# Altium project num_one.PrjPCB
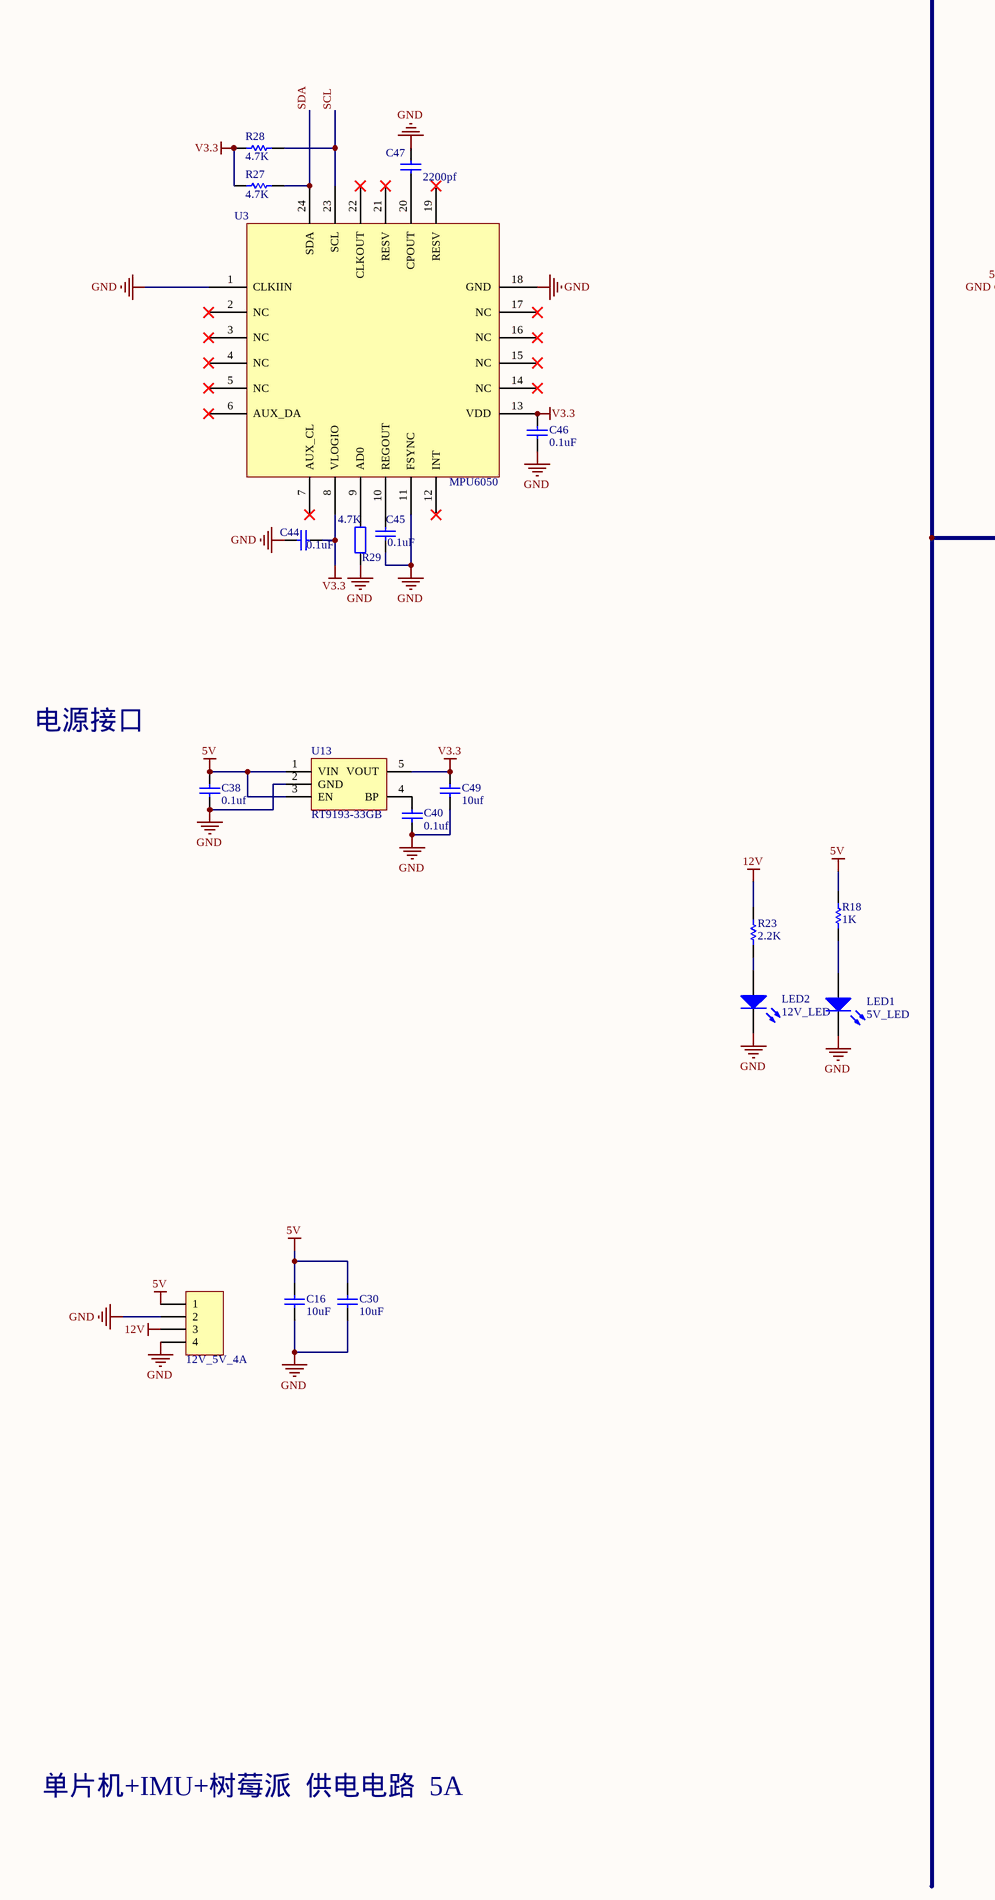
[diagram p0: num_one.SchDoc, left]
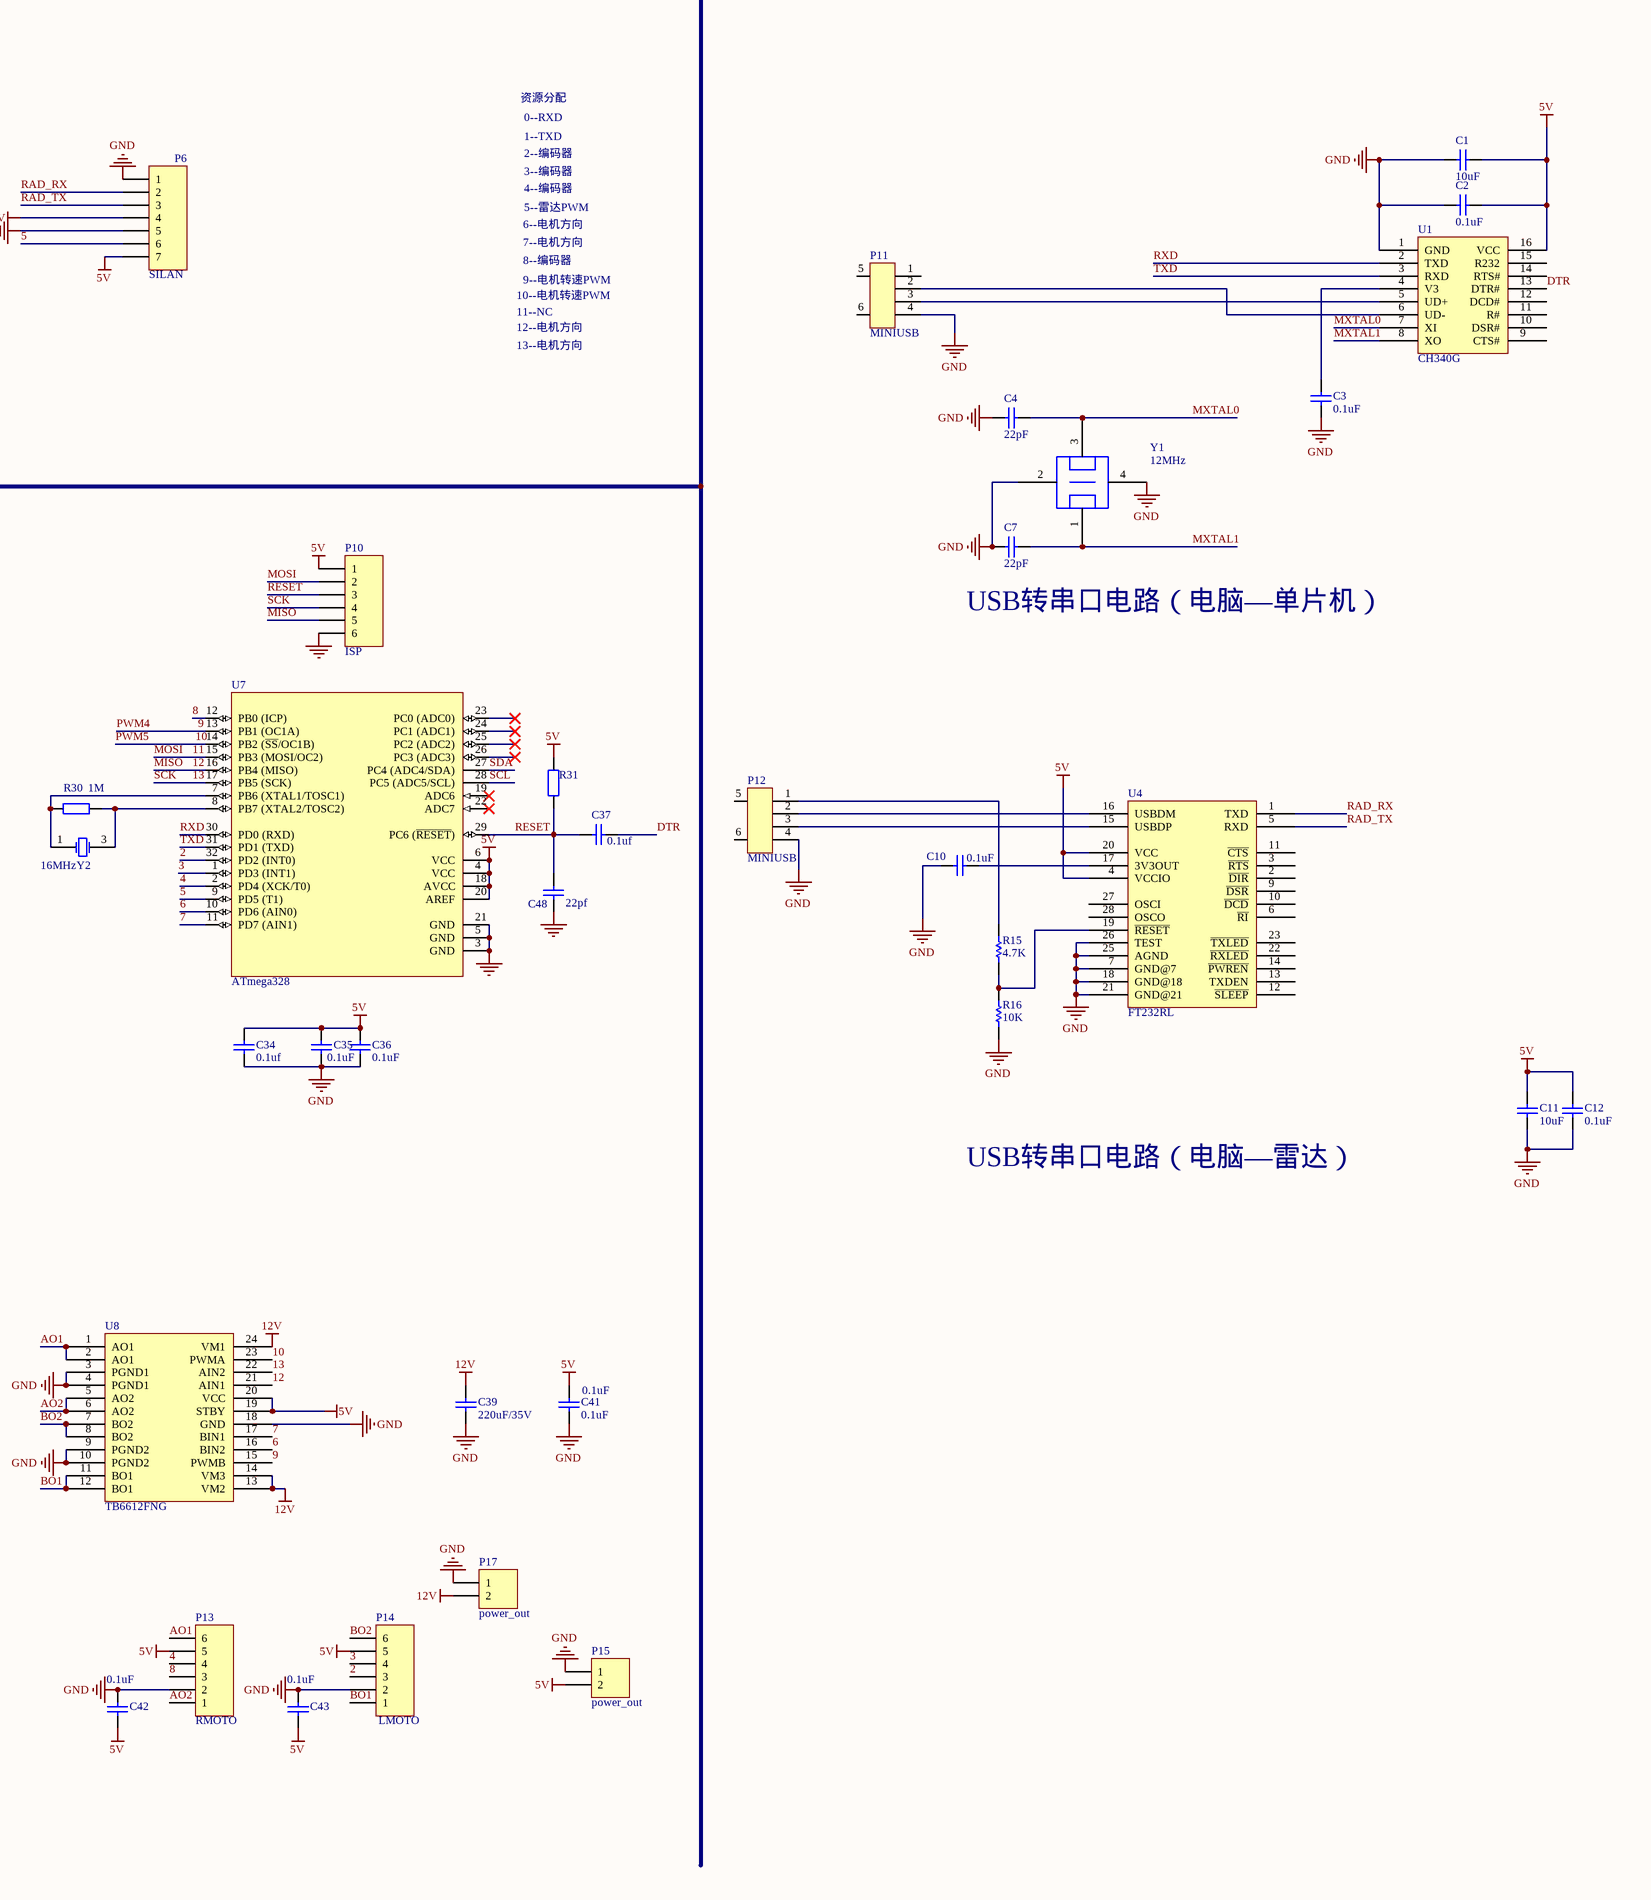
[diagram p1: num_one.SchDoc, right]
1 sheet, 54 parts. Net scope: global (net labels, ports and power ports of the same name join across sheets).
Board files: num_one.PcbDoc, ROSLOGO.PcbDoc, SLAMLOGO.PcbDoc

## Sheet num_one.SchDoc: 河南理工大学-形而上学队-原理图
size A2; Address1: 预留车灯接口; SheetNumber: 1

### Parts
C1  10uF  [0805C]
C2  0.1uF  [0805C]
C3  0.1uF  [0805C]
C4  22pF  [0805C]
C7  22pF  [0805C]
C10  0.1uF  [0805C]
C11  10uF  [0805C]
C12  0.1uF  [0805C]
C16  10uF  [0805C]
C30  10uF  [0805C]
C34  0.1uf  [0805]
C35  0.1uF  [0805]
C36  0.1uF  [0805]
C37  0.1uf  [0805]
C38  0.1uf  [0805C]
C39  220uF/35V  [1210]
C40  0.1uf  [0805C]
C41  0.1uF  [0805]
C42  0.1uF  [0805]
C43  0.1uF  [0805]
C44  0.1uF  [0805]
C45  0.1uF  [0805]
C46  0.1uF  [0805]
C47  2200pf  [0805]
C48  22pf  [0805]
C49  10uf  [0805C]
LED1  5V_LED  [0805D]
LED2  12V_LED  [0805D]
P2  12V_5V_4A  [2.54-4P]
P6  SILAN  [2.54-7P li]
P10  ISP  [HDR1X6]
P11  MINIUSB  [USB_MINI]
P12  MINIUSB  [USB_MINI]
P13  RMOTO  [2.54-6P]
P14  LMOTO  [2.54-6P]
P15  power_out  [2.54-2P]
P17  power_out  [2.54-2P]
R15  4.7K  [0805_RES]
R16  10K  [0805_RES]
R18  1K  [0805_RES]
R23  2.2K  [0805_RES]
R27  4.7K  [0805]
R28  4.7K  [0805]
R29  4.7K  [0805]
R30  1M  [0805]
R31  100K  [0805]  (value not drawn)
U1  CH340G  [SO-16_CH340]
U3  MPU6050  [QFN24]
U4  FT232RL  [FT232RL]
U7  ATmega328  [QFP32]
U8  TB6612FNG  [SSOP24]
U13  RT9193-33GB  [SOT23-5]
Y1  12MHz  [XTAL-3225]
Y2  16MHz  [TCJZ-3]

### Nets
5V: C1.1 C2.1 C11.1 C12.1 C16.2 C30.2 C34.2 C35.2 C36.2 C38.2 C41.2 C42.2 C43.2 P2.1 P6.4 P6.7 P10.1 P13.5 P14.5 P15.2 R18.1 R31.1 U1.16(VCC) U4.4(VCCIO) U4.20(VCC) U7.4(VCC) U7.6(VCC) U7.18(AVCC) U7.20(AREF) U8.19(STBY) U8.20(VCC) U13.1(VIN) U13.3(EN)
12V: C39.2 P2.3 P17.2 R23.1 U8.13(VM2) U8.14(VM3) U8.24(VM1)
GND: C1.2 C2.2 C3.1 C4.2 C7.2 C10.2 C11.2 C12.2 C16.1 C30.1 C34.1 C35.1 C36.1 C38.1 C39.1 C40.1 C41.1 C42.1 C43.1 C44.2 C45.1 C46.1 C47.2 C48.1 C49.1 LED1.K LED2.K P2.2 P2.4 P6.1 P6.5 P10.6 P11.4 P12.4 P13.2 P14.2 P15.1 P17.1 R16.2 R29.1 U1.1(GND) U3.1(CLKIIN) U3.11(FSYNC) U3.18(GND) U4.7(GND@7) U4.18(GND@18) U4.21(GND@21) U4.25(AGND) U4.26(TEST) U7.3(GND) U7.5(GND) U7.21(GND) U8.3(PGND1) U8.4(PGND1) U8.9(PGND2) U8.10(PGND2) U8.18(GND) U13.2(GND) Y1.2 Y1.4
V3.3: C44.1 C46.2 C49.2 R27.1 R28.1 U3.8(VLOGIO) U3.13(VDD) U13.5(VOUT)
2: P14.3 U7.32(PD2_(INT0))
3: P14.4 U7.1(PD3_(INT1))
4: P13.4 U7.2(PD4_(XCK/T0))
5: P6.6 U7.9(PD5_(T1))
6: U7.10(PD6_(AIN0)) U8.16(BIN2)
7: U7.11(PD7_(AIN1)) U8.17(BIN1)
8: P13.3 U7.12(PB0_(ICP))
9: U7.13(PB1_(OC1A)) U8.15(PWMB)  [also labelled PWM4]
10: U7.14(PB2_(~{SS}/OC1B)) U8.23(PWMA)  [also labelled PWM5]
11: P10.2 U7.15(PB3_(MOSI/OC2))  [also labelled MOSI]
12: P10.5 U7.16(PB4_(MISO)) U8.21(AIN1)  [also labelled MISO]
13: P10.4 U7.17(PB5_(SCK)) U8.22(AIN2)  [also labelled SCK]
AO1: P13.6 U8.1(AO1) U8.2(AO1)
AO2: P13.1 U8.5(AO2) U8.6(AO2)
BO1: P14.1 U8.11(BO1) U8.12(BO1)
BO2: P14.6 U8.7(BO2) U8.8(BO2)
DTR: C37.1 U1.13(DTR#)
MXTAL0: C4.1 U1.7(XI) Y1.3
MXTAL1: C7.1 U1.8(XO) Y1.1
RAD_RX: P6.2 U4.1(TXD)
RAD_TX: P6.3 U4.5(RXD)
RESET: C37.2 C48.2 P10.3 R31.2 U7.29(PC6_(~{RESET}))
RXD: U1.2(TXD) U7.30(PD0_(RXD))
SCL: R28.2 U3.23(SCL) U7.28(PC5_(ADC5/SCL))
SDA: R27.2 U3.24(SDA) U7.27(PC4_(ADC4/SDA))
TXD: U1.3(RXD) U7.31(PD1_(TXD))
NetC3_2: C3.2 U1.4(V3)
NetC10_1: C10.1 U4.17(3V3OUT)
NetC40_2: C40.2 U13.4(BP)
NetC45_2: C45.2 U3.10(REGOUT)
NetC47_1: C47.1 U3.20(CPOUT)
NetLED1_A: LED1.A R18.2
NetLED2_A: LED2.A R23.2
NetP11_2: P11.2 U1.6(UD-)
NetP11_3: P11.3 U1.5(UD+)
NetP12_1: P12.1 R15.1
NetP12_2: P12.2 U4.16(USBDM)
NetP12_3: P12.3 U4.15(USBDP)
NetR15_2: R15.2 R16.1 U4.19(~{RESET})
NetR29_2: R29.2 U3.9(AD0)
NetR30_1: R30.1 U7.7(PB6_(XTAL1/TOSC1)) Y2.1(OSC1)
NetR30_2: R30.2 U7.8(PB7_(XTAL2/TOSC2)) Y2.3(OSC2)

Not connected (* = marked no-connect by the designer): P11 1 5 6; P12 5 6; U1 9(CTS#) 10(DSR#) 11(R#) 12(DCD#) 14(RTS#) 15(R232); U3 2(NC)* 3(NC)* 4(NC)* 5(NC)* 6(AUX_DA)* 7(AUX_CL)* 12(INT)* 14(NC)* 15(NC)* 16(NC)* 17(NC)* 19(RESV)* 21(RESV)* 22(CLKOUT)*; U4 2(~{DIR}) 3(~{RTS}) 6(~{RI}) 9(~{DSR}) 10(~{DCD}) 11(~{CTS}) 12(~{SLEEP}) 13(TXDEN) 14(~{PWREN}) 22(~{RXLED}) 23(~{TXLED}) 27(OSCI) 28(OSCO); U7 19(ADC6)* 22(ADC7)* 23(PC0_(ADC0))* 24(PC1_(ADC1))* 25(PC2_(ADC2))* 26(PC3_(ADC3))*

### Notes on the sheet
- 资源分配
- 0--RXD
- 1--TXD
- 2--编码器
- 3--编码器
- 4--编码器
- 6--电机方向
- 7--电机方向
- 5--雷达PWM
- 10--电机转速PWM
- 11--NC
- 8--编码器
- 9--电机转速PWM
- 12--电机方向
- 13--电机方向
- (near C7) USB转串口电路（电脑—单片机）
- 电源接口
- USB转串口电路（电脑—雷达）
- 单片机+IMU+树莓派  供电电路  5A

### Library data of the parts
C1-C4 C7 C10-C12 C16 C30 = CAP
C34-C37 C41-C43 C48 = Cap: Published: 8-Jun-2000; LatestRevisionDate: 17-Jul-2002; LatestRevisionNote: Re-released for DXP Platform.; Publisher: Altium Limited
  C34-C36 C41-C43: Value: 0.1uF
  C37: Value: 0.1UF
  C48: Value: 22pf
C38 = Cap: capacitor; Published: 8-Jun-2000; LatestRevisionDate: 17-Jul-2002; LatestRevisionNote: Re-released for DXP Platform.; PackageReference: RAD-0.3; Publisher: Altium Limited; PackageDescription: Radial Cap, Thru-Hole; 2 Leads; 0.3 in Pin Spacing
C39 = Cap: 钽电容; Published: 8-Jun-2000; LatestRevisionDate: 17-Jul-2002; LatestRevisionNote: Re-released for DXP Platform.; Publisher: Altium Limited; Value: 220uF/35V
C40 C49 = Cap: Capacitor; Published: 8-Jun-2000; LatestRevisionDate: 17-Jul-2002; LatestRevisionNote: Re-released for DXP Platform.; PackageReference: RAD-0.3; Publisher: Altium Limited; PackageDescription: Radial Cap, Thru-Hole; 2 Leads; 0.3 in Pin Spacing
C44-C47 = Cap: 0805贴片电容; Published: 8-Jun-2000; LatestRevisionDate: 17-Jul-2002; LatestRevisionNote: Re-released for DXP Platform.; Publisher: Altium Limited
LED1 LED2 = LED
P2 = Header 4: Header, 4-Pin; LatestRevisionDate: 17-Jul-2002; LatestRevisionNote: Re-released for DXP Platform.; Publisher: Altium Limited
P6 = Header 7: Header, 7-Pin; LatestRevisionDate: 17-Jul-2002; LatestRevisionNote: Re-released for DXP Platform.; Publisher: Altium Limited
P10 = Header 6: 2.54-6P排针; LatestRevisionDate: 17-Jul-2002; LatestRevisionNote: Re-released for DXP Platform.; Publisher: Altium Limited
P11 P12 = USB-B: 贴片
P13 P14 = Header 6: 2.54-6P卧贴; LatestRevisionDate: 17-Jul-2002; LatestRevisionNote: Re-released for DXP Platform.; Publisher: Altium Limited
P15 P17 = 2P: 2.54-2P卧贴
R15 R16 R18 R23 R27 R28 = RES
R29 = Res2: Resistor; Published: 8-Jun-2000; LatestRevisionDate: 17-Jul-2002; LatestRevisionNote: Re-released for DXP Platform.; Publisher: Altium Limited
R30 R31 = Res2: Published: 8-Jun-2000; LatestRevisionDate: 17-Jul-2002; LatestRevisionNote: Re-released for DXP Platform.; Publisher: Altium Limited
  R30: Value: 1M
  R31: Value: 100K
U1 = CH340G: USB芯片
U4 = FT232RL: USB芯片
U7 = ATmega8-16AC: 8位单片机; PackageDocument: revB, Oct-2001; Published: 17-Sep-2003; DatasheetDocument: 2486H-AVR-09/02; PackageReference: 32A; Publisher: Altium Limited; Code_JEDEC: MS-026-ABA
U8 = TB6612: 电机驱动芯片
U13 = RT9193: 电源芯片
Y1 = XTAL: 有源晶振
Y2 = XTAL: 3212村田陶瓷晶振; value: 16M; Published: 8-Jun-2000; LatestRevisionDate: 17-Jul-2002; LatestRevisionNote: Re-released for DXP Platform.; Publisher: Altium Limited